# EAGLE design Oscillatore di riferimento intonazione (EAGLE 7.6.0)
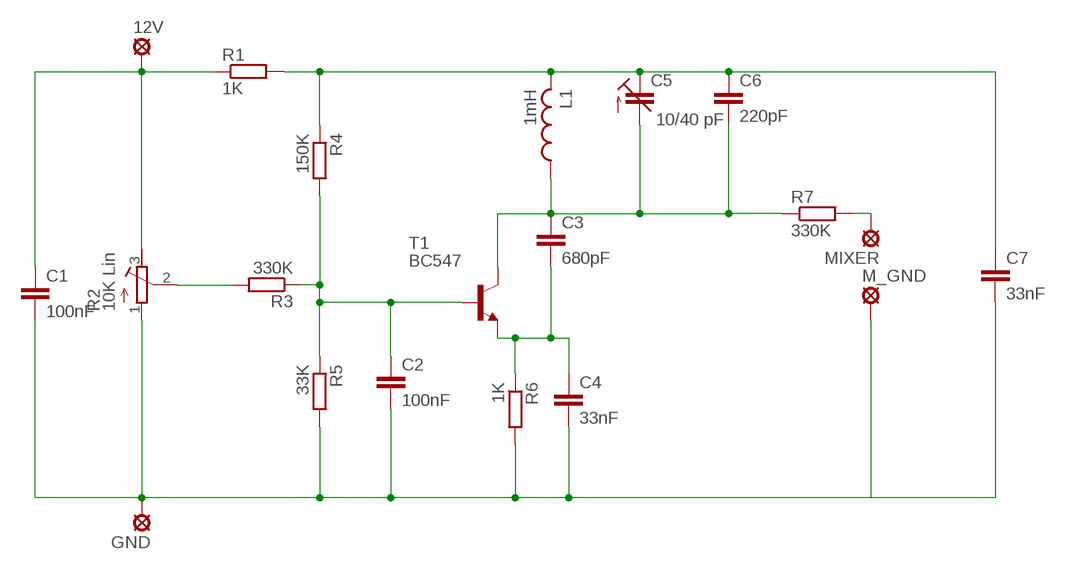
[diagram p0: schematic, sheet 1]

## Parts
12V  LSP13  [LSP13]
C1  100nF  C7.5/3  [C7.5B3]
C2  100nF  C7.5/3  [C7.5B3]
C3  680pF  C7.5/3  [C7.5B3]
C4  33nF  C7.5/3  [C7.5B3]
C5  10/40 pF  C-TRIMM3008  [3008]
C6  220pF  C7.5/3  [C7.5B3]
C7  33nF  C7.5/3  [C7.5B3]
GND  LSP13  [LSP13]
L1  1mH  L-US0204/7  [0204/7]
M_GND  LSP13  [LSP13]
MIXER  LSP13  [LSP13]
R1  1K  R-EU_0207/10  [0207/10]
R2  10K Lin  R-TRIMM3339P  [RTRIM3339P]
R3  330K  R-EU_0207/10  [0207/10]
R4  150K  R-EU_0207/10  [0207/10]
R5  33K  R-EU_0207/10  [0207/10]
R6  1K  R-EU_0207/10  [0207/10]
R7  330K  R-EU_0207/10  [0207/10]
T1  BC547  [TO92]

## Nets
N$2: 12V.MP C1.1 R1.1 R2.3(E)
N$3: C5.+(E) C6.1 C7.1 L1.2 R1.2 R4.1
N$5: C2.1 R3.1 R4.2 R5.1 T1.2(B)
N$6: R2.2(S) R3.2
N$7: C3.2 C4.1 R6.1 T1.1(E)
N$9: MIXER.MP R7.2
N$11: C1.2 C2.2 C4.2 C7.2 GND.MP M_GND.MP R2.1(A) R5.2 R6.2
N$12: C3.1 C5.-(A) C6.2 L1.1 R7.1 T1.3(C)

## Library data of the parts
12V GND M_GND MIXER = solpad:LSP13: SOLDER PAD drill 1.3 mm, distributor Buerklin, 12H562
C1-C4 C6 C7 = capacitor-wima:C: CAPACITOR naming: grid - package width
C5 = c-trimm:C-TRIMM: Trimm capacitor; OC_FARNELL: unknown; OC_NEWARK: unknown
L1 = rcl:L-US: INDUCTOR, American symbol
R1 R3-R7 = resistor:R-EU_: RESISTOR, European symbol
R2 = resistor:R-TRIMM: Trimm resistor
T1 = transistor:BC547: NPN TRANSISTOR

## Board
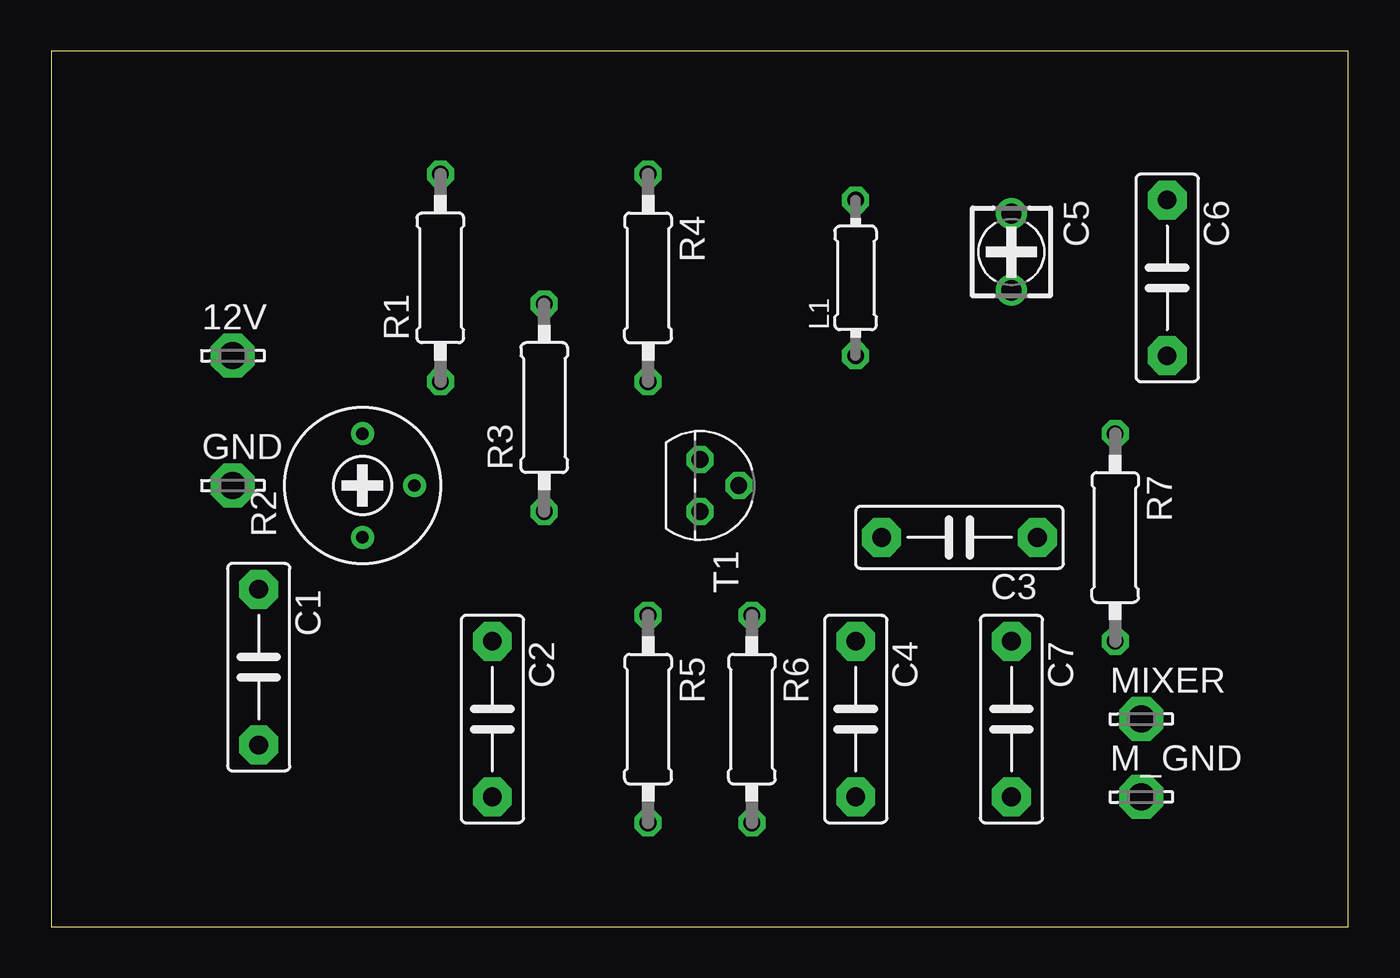
[diagram p1: board, top side]
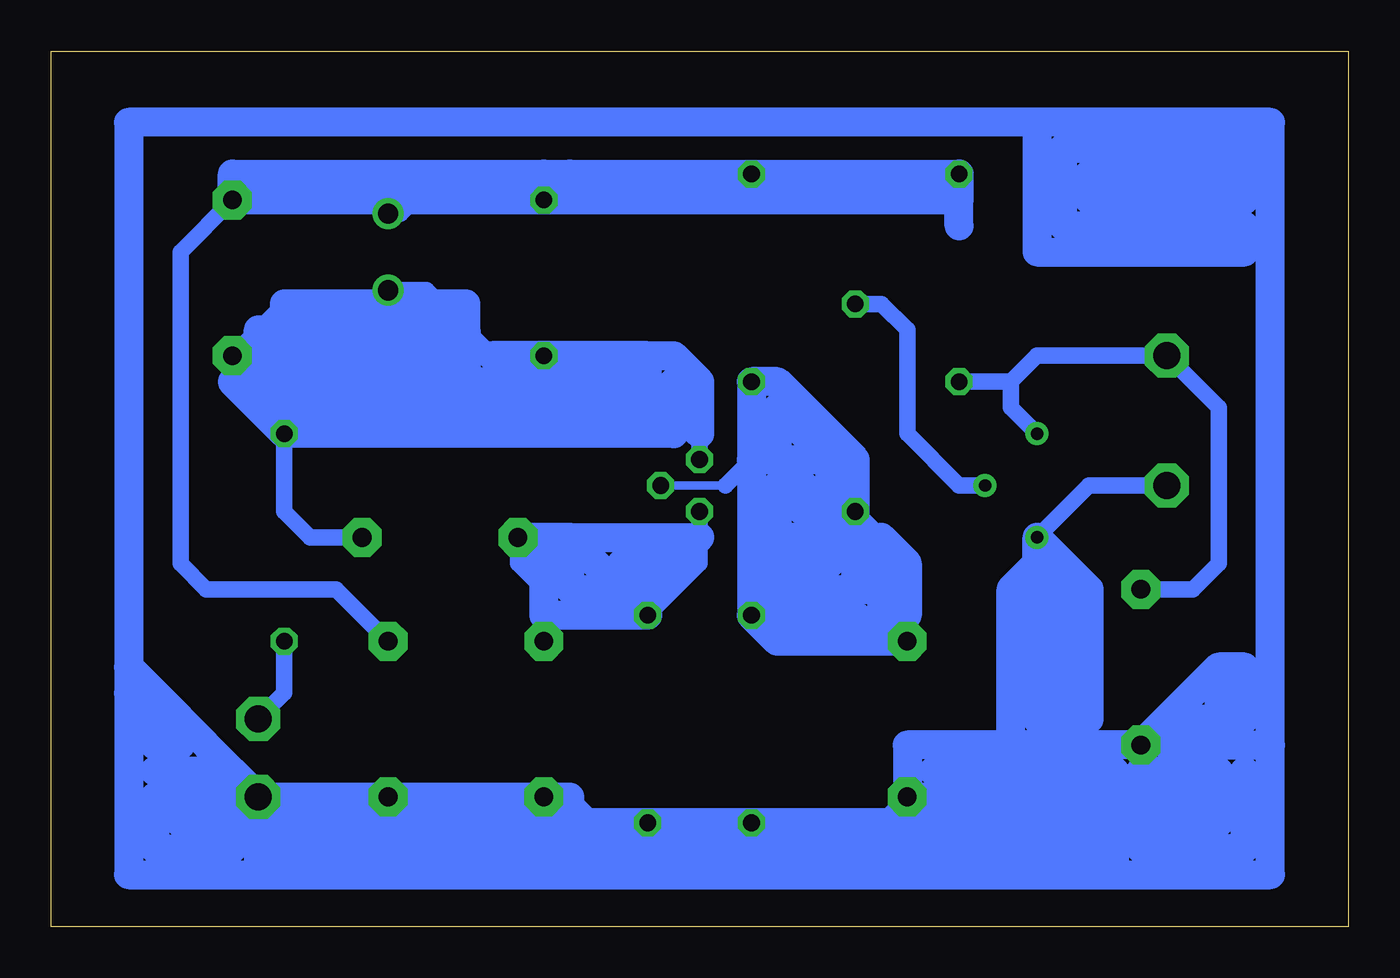
[diagram p2: board, bottom side, seen from below]

Size 63.48 x 42.85 mm. Coordinates in mm from the lower left corner, seen from the top.
Outline: 0,0 63.48,0 63.48,42.85 0,42.85 0,0
Copper layers (1*16): Top 0.035mm / dielectric 1.5mm / Bottom 0.035mm
Design rules "default": minimum track width 10mil, minimum drill 24mil, track to track 8mil, track to pad 8mil, pad to pad 8mil, via to via 8mil, smd to smd 8mil, copper to edge 40mil, drill to drill 8mil, minimum pad ring 10mil, minimum via ring 8mil, stop-mask expansion 4mil, vias tented up to drill 0mil, thermal gap 10mil

### Footprints (pad centres in the part's own frame; a part is rotated, then mirrored left to right if it is on the bottom)
LSP13 = drill 1.321 pad 2.159 octagon: MP 0,0
C7.5B3 = drill 0.914 pad 1.905 octagon: 1 -3.81,0; 2 3.81,0
3008 = drill 1: + -1.875,0; - 1.875,0
0204/7 = drill 0.813 octagon: 1 -3.81,0; 2 3.81,0
0207/10 = drill 0.813 octagon: 1 -5.08,0; 2 5.08,0
RTRIM3339P = drill 0.61: 1 -2.54,0; 2 0,-2.54; 3 2.54,0
TO92 = drill 0.813 octagon: 1 1.27,0; 2 0,1.905; 3 -1.27,0

### Placement (x,y rotation side)
12V  8.89,27.94 0 top
C1  10.16,12.7 270 top
C2  21.59,10.16 270 top
C3  44.45,19.05 180 top
C4  39.37,10.16 270 top
C5  46.99,33.02 270 top
C6  54.61,31.75 270 top
C7  46.99,10.16 270 top
GND  8.89,21.59 0 top
L1  39.37,31.75 90 top
M_GND  53.34,6.35 0 top
MIXER  53.34,10.16 0 top
R1  19.05,31.75 90 top
R2  15.24,21.59 90 top
R3  24.13,25.4 90 top
R4  29.21,31.75 270 top
R5  29.21,10.16 270 top
R6  34.29,10.16 270 top
R7  52.07,19.05 270 top
T1  31.75,21.59 270 top

### Tracks (layer width: path | path; a pad name or v marks a point on that pad's centre or on a via)
N$2
  Bottom 0.813: 16.51,26.67 15.24,27.94 12V.MP 6.35,25.4 6.35,17.78 7.62,16.51 C1.1 | 16.51,26.67 R1.1 | R2.3 16.51,25.4 16.51,26.67
N$3
  Bottom 0.813: R1.2 R4.1 36.83,36.83 38.1,35.56 L1.2 45.72,35.56 46.39,34.89 C5.+ 47.66,35.56 C6.1 57.15,33.02 57.15,17.78 55.88,16.51 49.53,16.51 C7.1
  Bottom 1.422: 19.05,35.56 R1.2 38.1,36.83 | 19.05,34.29 19.05,35.56 | 19.05,35.56 L1.2 39.37,36.83 | 39.37,36.83 38.1,36.83 | 38.1,36.83 38.1,35.56 C6.1 54.61,36.83 39.37,36.83
N$5
  Bottom 0.406: T1.2 30.48,21.59
  Bottom 0.813: C2.1 21.59,15.24 | 22.86,19.05 R3.1 | R3.1 25.4,20.32 | 27.94,22.86 28.57,23.5 | 28.57,23.5 29.21,24.13 R4.2 | R3.1 26.67,17.78 R5.1 | 30.48,21.59 29.21,22.86 28.57,23.5
  Bottom 1.422: 29.21,22.86 R5.1 | 27.94,16.51 27.94,19.05 | 27.94,19.05 27.94,21.59 26.67,20.32 25.4,20.32 | 25.4,20.32 26.67,19.05 27.94,19.05 | 27.94,19.05 26.67,17.78 | R3.1 24.13,22.86 27.94,26.67 R4.2 29.21,22.86 | 29.21,22.86 27.94,22.86 | 27.94,22.86 25.4,22.86 | 25.4,22.86 25.4,20.32 | 25.4,20.32 27.94,22.86 | 27.94,22.86 27.94,25.4 25.4,22.86 | C2.1 22.86,13.97 | 22.86,13.97 27.94,13.97 R5.1 | R5.1 27.94,16.51 | 27.94,16.51 24.13,16.51 | 24.13,16.51 22.86,16.51 | 22.86,16.51 22.86,17.78 | 22.86,16.51 22.86,13.97 | 22.86,13.97 24.13,15.24 27.94,15.24 24.13,19.05 24.13,16.51 | 24.13,16.51 22.86,17.78 | 22.86,17.78 22.86,19.05 21.59,17.78 21.59,15.24
N$6
  Bottom 0.813: R3.2 22.86,30.48 21.59,29.21 21.59,24.13 19.05,21.59 R2.2
N$7
  Bottom 0.813: C4.1 39.37,15.24 39.37,16.51 40.64,17.78 C3.2 | T1.1 31.75,19.05 31.75,17.78 R6.1 35.56,16.51
  Bottom 1.422: R6.1 39.37,15.24 39.37,17.78 | C3.2 39.37,17.78 | 39.37,17.78 38.1,17.78 38.1,16.51 35.56,16.51 38.1,19.05 C3.2 | C3.2 31.75,19.05 33.02,17.78 | 33.02,17.78 34.29,16.51 35.56,17.78 33.02,17.78
N$9
  Bottom 0.813: R7.2 52.07,11.43 MIXER.MP
N$11
  Bottom 0.813: GND.MP 12.7,21.59 R2.1 | C1.2 10.16,7.62 | 10.16,6.35 11.43,5.08 15.24,5.08 | 15.24,5.08 20.32,5.08 C2.2 22.86,5.08 R5.2 R6.2 36.83,5.08 38.1,6.35 C4.2 | 40.64,6.35 C4.2 | C4.2 C7.2 M_GND.MP | 15.24,17.78 15.24,5.08
  Bottom 1.422: 5.08,12.7 6.35,12.7 C1.2 | 5.08,7.62 5.08,3.81 10.16,3.81 10.16,5.08 | 5.08,39.37 3.81,39.37 3.81,8.89 | 5.08,39.37 15.24,39.37 | 15.24,39.37 59.69,39.37 59.69,12.7 | 59.69,12.7 59.69,11.43 | 59.69,11.43 59.69,2.54 53.34,2.54 | 53.34,2.54 11.43,2.54 | 11.43,2.54 3.81,2.54 3.81,8.89 | 11.43,3.81 11.43,5.08 38.1,5.08 | 53.34,5.08 53.34,3.81 | 53.34,3.81 53.34,2.54 | 53.34,3.81 11.43,3.81 | 11.43,2.54 11.43,3.81 | 38.1,5.08 53.34,5.08 | 53.34,5.08 M_GND.MP | M_GND.MP 38.1,6.35 38.1,5.08 | 8.89,8.89 3.81,8.89 | 10.16,6.35 10.16,7.62 6.35,7.62 6.35,6.35 | 6.35,6.35 6.35,5.08 10.16,5.08 | 10.16,5.08 10.16,6.35 | 10.16,6.35 6.35,6.35 | C1.2 13.97,8.89 | 13.97,8.89 16.51,8.89 | 16.51,8.89 21.59,8.89 C2.2 11.43,6.35 11.43,7.62 20.32,7.62 | M_GND.MP 54.61,6.35 | 57.15,6.35 58.42,6.35 58.42,3.81 54.61,3.81 54.61,5.08 | 54.61,5.08 54.61,6.35 | 54.61,6.35 57.15,6.35 | 57.15,6.35 57.15,5.08 54.61,5.08 | 15.24,39.37 15.24,33.02 5.08,33.02 5.08,34.29 13.97,34.29 13.97,38.1 5.08,38.1 | 5.08,38.1 5.08,39.37 | 5.08,38.1 5.08,36.83 | 5.08,36.83 5.08,35.56 12.7,35.56 12.7,36.83 5.08,36.83 | C1.2 8.89,10.16 6.35,10.16 | 6.35,10.16 5.08,10.16 5.08,12.7 | 5.08,12.7 6.35,11.43 6.35,10.16 | M_GND.MP 54.61,7.62 | 57.15,10.16 59.69,12.7 | 58.42,7.62 54.61,7.62 | 54.61,7.62 57.15,10.16 | 57.15,10.16 58.42,10.16 58.42,8.89 57.15,8.89 59.69,11.43 | 13.97,8.89 12.7,10.16 12.7,16.51 R2.1 15.24,17.78 | 13.97,8.89 15.24,10.16 15.24,17.78 | 15.24,17.78 13.97,16.51 13.97,10.16 | 16.51,8.89 16.51,16.51 15.24,17.78
N$12
  Bottom 0.813: C3.1 50.8,19.05 52.07,20.32 R7.1 53.34,25.4 54.61,26.67 C6.2 52.07,30.48 47.66,30.48 C5.- 45.12,31.14 43.18,29.21 41.91,27.94 L1.1 36.83,27.94 35.56,27.94 34.29,26.67 31.75,24.13 T1.3
  Bottom 1.422: 33.02,25.4 33.02,24.13 R7.1 54.61,26.67 | 33.02,25.4 52.07,25.4 52.07,26.67 | 52.07,26.67 53.34,26.67 | 53.34,26.67 53.34,27.94 | 53.34,27.94 C6.2 | 53.34,25.4 53.34,26.67 | 53.34,27.94 53.34,29.21 43.18,29.21 | 43.18,29.21 43.18,27.94 | 43.18,27.94 43.18,26.67 50.8,26.67 50.8,27.94 | 50.8,27.94 52.07,27.94 | 50.8,27.94 43.18,27.94 | 43.18,29.21 43.18,30.48 52.07,30.48 52.07,26.67 | 52.07,26.67 34.29,26.67 34.29,27.94 | 34.29,27.94 36.83,27.94 41.91,27.94 | 34.29,27.94 33.02,27.94 31.75,26.67 31.75,24.13 33.02,25.4 | 33.02,25.4 33.02,26.67